# Altium schematic sheet 04_POWER.SchDoc
size 420 x 297 mm; SheetNumber: 4; SheetTotal: 27
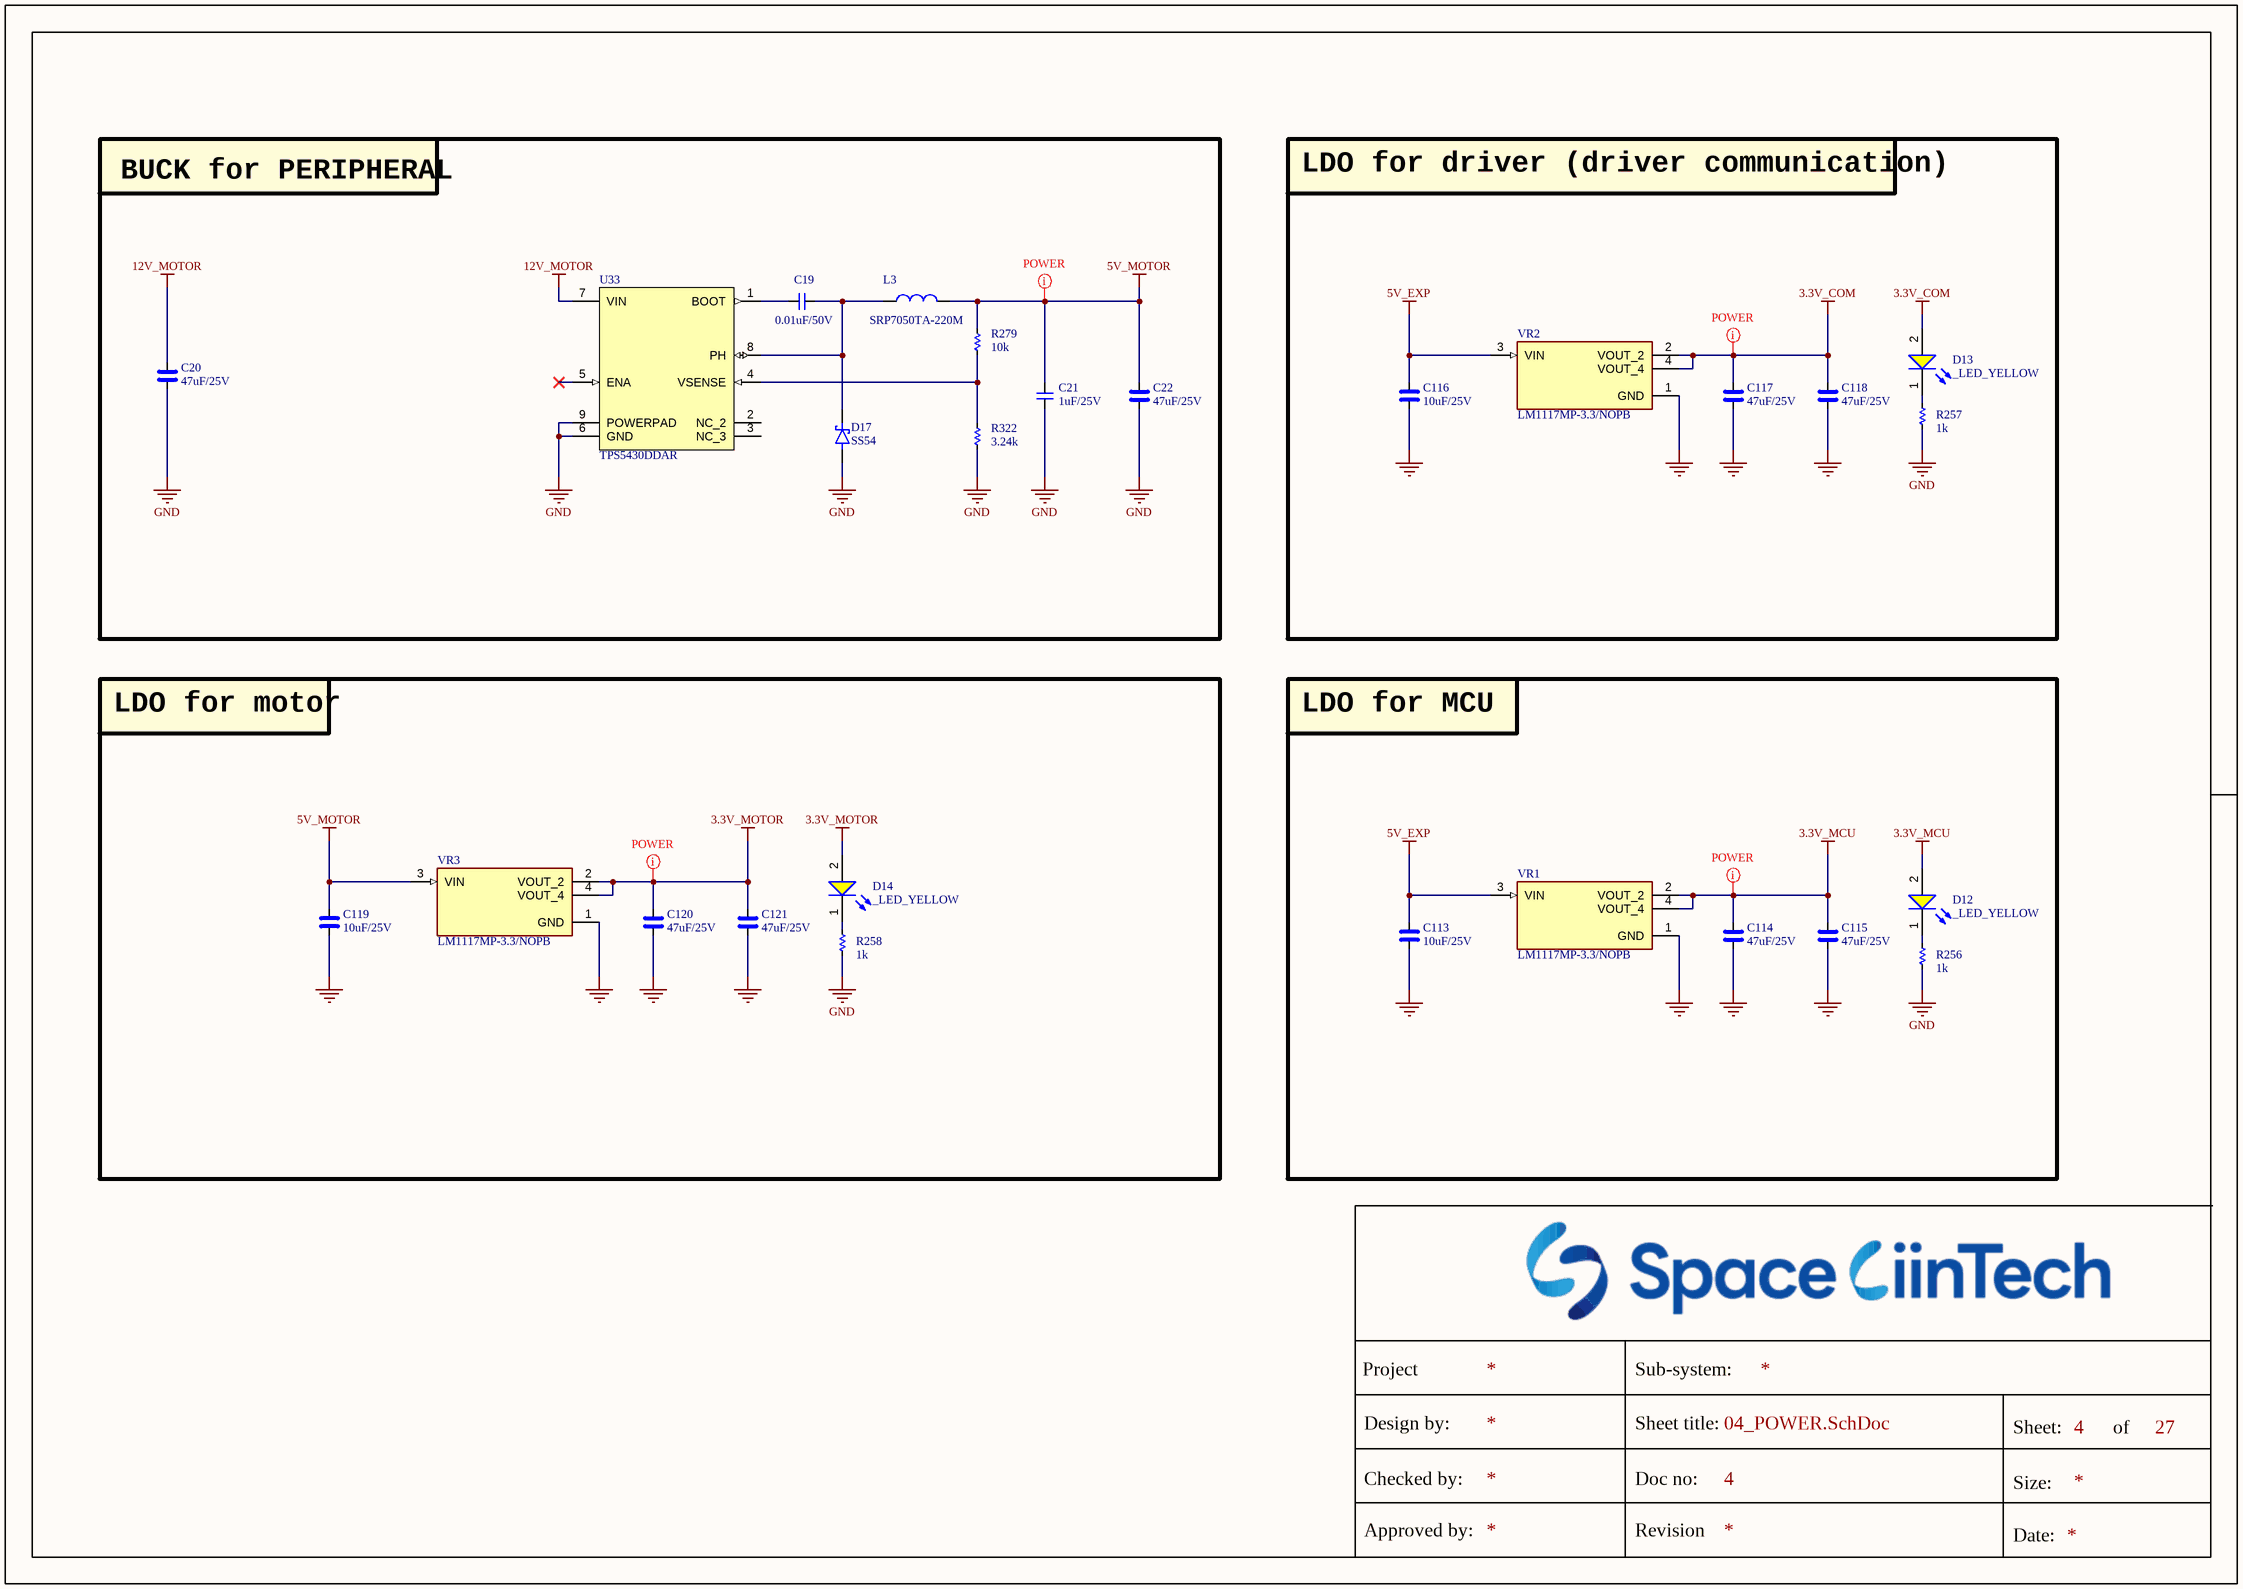
[diagram p0: 04_POWER.SchDoc]

## Parts
C19  0.01uF/50V  [CAP_C_1608X80]
C20  47uF/25V  [CAP_C_3225X80]
C21  1uF/25V  [CAP_C_1005X60]
C22  47uF/25V  [CAP_C_3225X80]
C113  10uF/25V  [CAP_C_2012X110]
C114  47uF/25V  [CAP_C_3225X80]
C115  47uF/25V  [CAP_C_3225X80]
C116  10uF/25V  [CAP_C_2012X110]
C117  47uF/25V  [CAP_C_3225X80]
C118  47uF/25V  [CAP_C_3225X80]
C119  10uF/25V  [CAP_C_2012X110]
C120  47uF/25V  [CAP_C_3225X80]
C121  47uF/25V  [CAP_C_3225X80]
D12  _LED_YELLOW  [LED_0603]
D13  _LED_YELLOW  [LED_0603]
D14  _LED_YELLOW  [LED_0603]
D17  SS54  [DO-214AC_SMA]
L3  SRP7050TA-220M  [PSM6050]
R256  1k  [RES_C_1005X40]
R257  1k  [RES_C_1005X40]
R258  1k  [RES_C_1005X40]
R279  10k  [RES_C_1005X40]
R322  3.24k  [RES_C_1005X40]
U33  TPS5430DDAR  [TPS54531DDAR]
VR1  LM1117MP-3.3/NOPB  [VREG_LM1117MP-3.3/NOPB]
VR2  LM1117MP-3.3/NOPB  [VREG_LM1117MP-3.3/NOPB]
VR3  LM1117MP-3.3/NOPB  [VREG_LM1117MP-3.3/NOPB]

## Blocks framed on the sheet
BUCK for PERIPHERAL: C19-C22 D17 L3 R279 R322 U33
LDO for driver (driver communication): C116-C118 D13 R257 VR2
LDO for motor: C119-C121 D14 R258 VR3
LDO for MCU: C113-C115 D12 R256 VR1

## Nets
3.3V_COM: C117.2 C118.2 D13.2(A) VR2.2(VOUT_2) VR2.4(VOUT_4)
3.3V_MCU: C114.2 C115.2 D12.2(A) VR1.2(VOUT_2) VR1.4(VOUT_4)
3.3V_MOTOR: C120.2 C121.2 D14.2(A) VR3.2(VOUT_2) VR3.4(VOUT_4)
5V_EXP: C113.1 C116.1 VR1.3(VIN) VR2.3(VIN)
5V_MOTOR: C21.2 C22.2 C119.1 L3.2 R279.2 VR3.3(VIN)
12V_MOTOR: C20.2 U33.7(VIN)
GND: C20.1 C21.1 C22.1 C113.2 C114.1 C115.1 C116.2 C117.1 C118.1 C119.2 C120.1 C121.1 D17.2(A) R256.1 R257.1 R258.1 R322.1 U33.6(GND) U33.9(POWERPAD) VR1.1(GND) VR2.1(GND) VR3.1(GND)
NetC19_1: C19.1 D17.1(K) L3.1 U33.8(PH)
NetC19_2: C19.2 U33.1(BOOT)
NetD12_1: D12.1(K) R256.2
NetD13_1: D13.1(K) R257.2
NetD14_1: D14.1(K) R258.2
NetR279_1: R279.1 R322.2 U33.4(VSENSE)

Not connected (* = marked no-connect by the designer): U33 2(NC_2) 3(NC_3) 5(ENA)*

## Layout directives
net class POWER: 3.3V_COM, 3.3V_MCU, 3.3V_MOTOR, 5V_MOTOR

## Notes on the sheet
- Project
- Sub-system:
- Design by:
- Sheet title:
- Sheet:
- of
- Checked by:
- Approved by:
- Doc no:
- Revision
- Size:
- Date:

## Library data of the parts
C19 C21 = _CAP_C_2: CAP
C20 C22 C113-C121 = _CAP_C_High_2: CAP High Value
D17 = DIODE SCHOTTKY
L3 = SRP7050TA-220M: FIXED IND 22UH 2.5A 170 MOHM SMD
R256-R258 R279 R322 = _RES_B_2: RES
U33 = TPS5430DDAR: IC REG BUCK ADJ 3A 8SOPWR
VR1-VR3 = LM1117MP-3.3/NOPB: 800-mA 15-V linear voltage regulator; MF: Texas Instruments; SnapEDA_Link: https://www.snapeda.com/parts/LM1117MP-3.3/NOPB/Texas+Instruments/view-part/?ref=snap; Package: SOT-223-4 Texas Instruments; Value: *; MP: LM1117MP-3.3/NOPB; Check_prices: https://www.snapeda.com/parts/LM1117MP-3.3/NOPB/Texas+Instruments/view-part/?ref=eda